# EAGLE design PIC18F2550-USB-HID-LC-Meter (EAGLE 7.7.0)
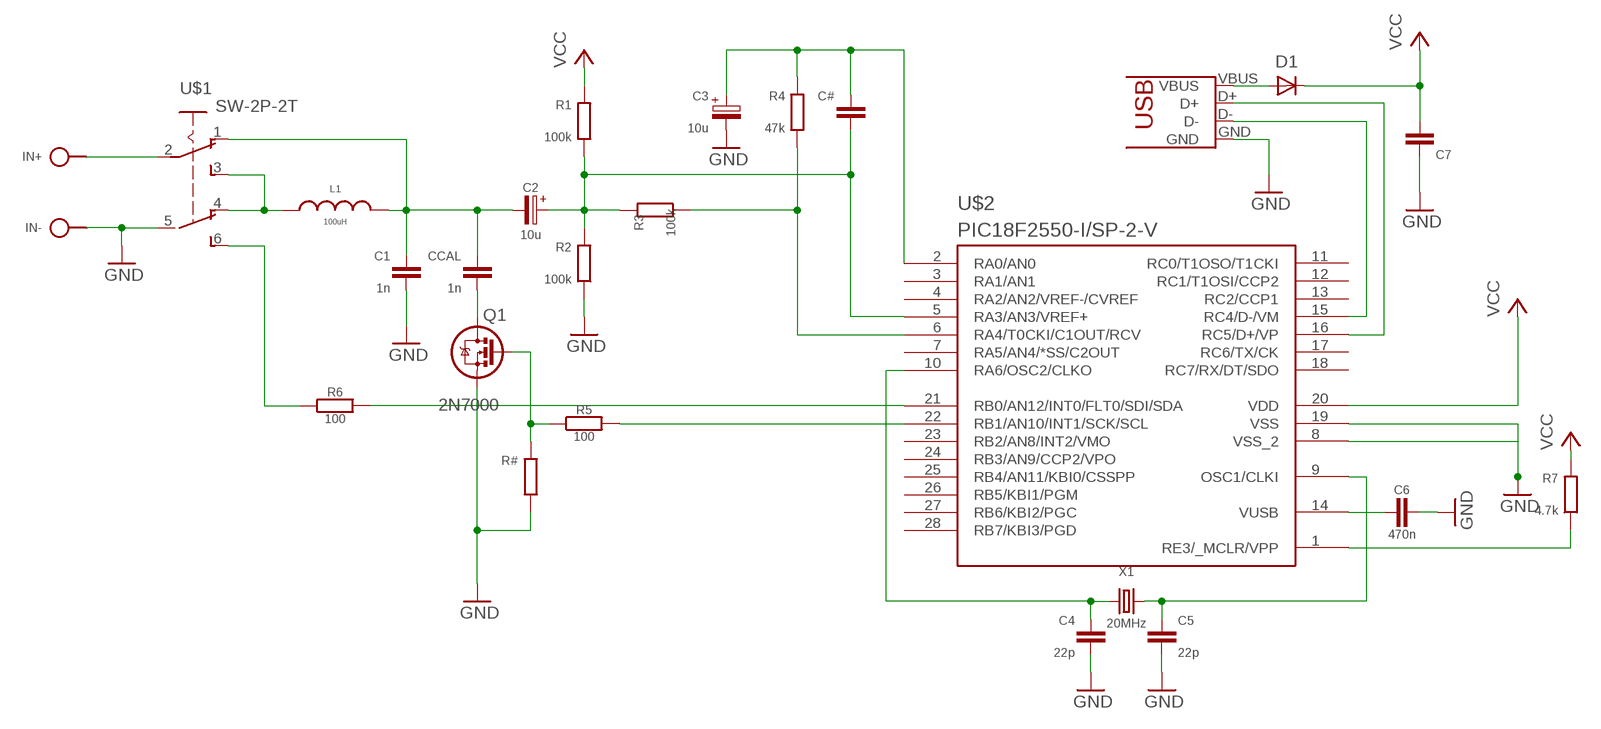
[diagram p0: schematic, sheet 1]

## Parts
C1  1n  C050-020X036  [C050-020X036]
C2  10u  CPOLE2,5-4/V  [E2.5-4/V]
C3  10u  CPOLE2,5-4  [E2,5-4]
C4  22p  C025-015X024  [C025-015X024/V]
C5  22p  C025-015X024  [C025-015X024/V]
C6  470n  C050-020X036  [C050-020X036]
C7  C050-020X036  [C050-020X036]
C#  C050-020X036  [C050-020X036]
CCAL  1n  C050-020X036  [C050-020X036]
D1  1N414834-5  [DO34-5]
IN+  SPAD  [SPAD]
IN-  SPAD  [SPAD]
J1  USB-PRINT  [USB-B-PRINT]
L1  100uH  L04/7-M  [L-04/7-M]
Q1  2N7000  [TO92]
R1  100k  R0202/7  [0202/7]
R2  100k  R0202/7  [0202/7]
R3  100k  R0202/7  [0202/7]
R4  47k  R0202/7  [0202/7]
R5  100  R0202/7  [0202/7]
R6  100  R0202/7  [0202/7]
R7  4.7k  R0202/7  [0202/7]
R#  R0202/7  [0202/7]
U$1  SW-2P-2T  [SLSW-2P2T]
U$2  PIC18F2550-I/SP-2-V  [DIL28-3/V]
X1  20MHz  CRYSTALHC49  [HC49]

## Nets
GND: C1.2 C3.- C4.2 C5.2 C6.2 C7.1 IN-.1 J1.GND Q1.1(S) R2.1 R#.1 U$1.5(P1) U$2.8(VSS_2) U$2.19(VSS)
N$1: Q1.2(G) R5.1 R#.2
N$2: R7.1 U$2.1(RE3/_MCLR/VPP)
N$3: J1.D- U$2.15(RC4/D-/VM)
N$4: J1.D+ U$2.16(RC5/D+/VP)
N$6: C2.+ C#.2 R1.1 R2.2 R3.2 U$2.5(RA3/AN3/VREF+)
N$7: C3.+ C#.1 R4.2 U$2.2(RA0/AN0)
N$8: R3.1 R4.1 U$2.6(RA4/T0CKI/C1OUT/RCV)
N$9: C1.1 C2.- CCAL.1 L1.2 U$1.1(O)
N$10: R5.2 U$2.22(RB1/AN10/INT1/SCK/SCL)
N$11: CCAL.2 Q1.3(D)
N$12: C4.1 U$2.10(RA6/OSC2/CLKO) X1.1
N$13: C5.1 U$2.9(OSC1/CLKI) X1.2
N$14: C6.1 U$2.14(VUSB)
N$15: L1.1 U$1.3(S) U$1.4(O1)
N$16: IN+.1 U$1.2(P)
N$17: R6.1 U$1.6(S1)
N$18: R6.2 U$2.21(RB0/AN12/INT0/FLT0/SDI/SDA)
VCC: C7.2 D1.C R1.2 R7.2 U$2.20(VDD)
VDD: D1.A J1.VBUS
Unconnected: U$2.3(RA1/AN1) U$2.4(RA2/AN2/VREF-/CVREF) U$2.7(RA5/AN4/*SS/C2OUT) U$2.11(RC0/T1OSO/T1CKI) U$2.12(RC1/T1OSI/CCP2) U$2.13(RC2/CCP1) U$2.17(RC6/TX/CK) U$2.18(RC7/RX/DT/SDO) U$2.23(RB2/AN8/INT2/VMO) U$2.24(RB3/AN9/CCP2/VPO) U$2.25(RB4/AN11/KBI0/CSSPP) U$2.26(RB5/KBI1/PGM) U$2.27(RB6/KBI2/PGC) U$2.28(RB7/KBI3/PGD)

## Library data of the parts
C1 C4-C7 C# CCAL = c:C: CAPACITOR, European symbol
C2 C3 = c:CPOL: POLARIZED CAPACITOR, European symbol
D1 = d:1N4148
IN+ IN- = pad:SPAD
J1 = usb:USB: USB Connectors USB-B-PTH is fully proven SKU : PRT-00139 USB-miniB is fully proven SKU : PRT-00587 USB-A-PCB is untested. USB-A-H is throughly reviewed, but untested. Spark Fun Electronics SKU : PRT-00437 USB-B-SMT is throughly reviewed, but untested. Needs silkscreen touching up. USB-A-S has not been used/tested USB-MB-H has not been used/tested
L1 = r:L
Q1 = t:2N7000
R1-R7 R# = r:R: RESISTOR, European symbol
U$1 = sw:SW-2P-2T
U$2 = mcu:PIC18F2550-I/SP-2
X1 = q:CRYSTAL

## Board
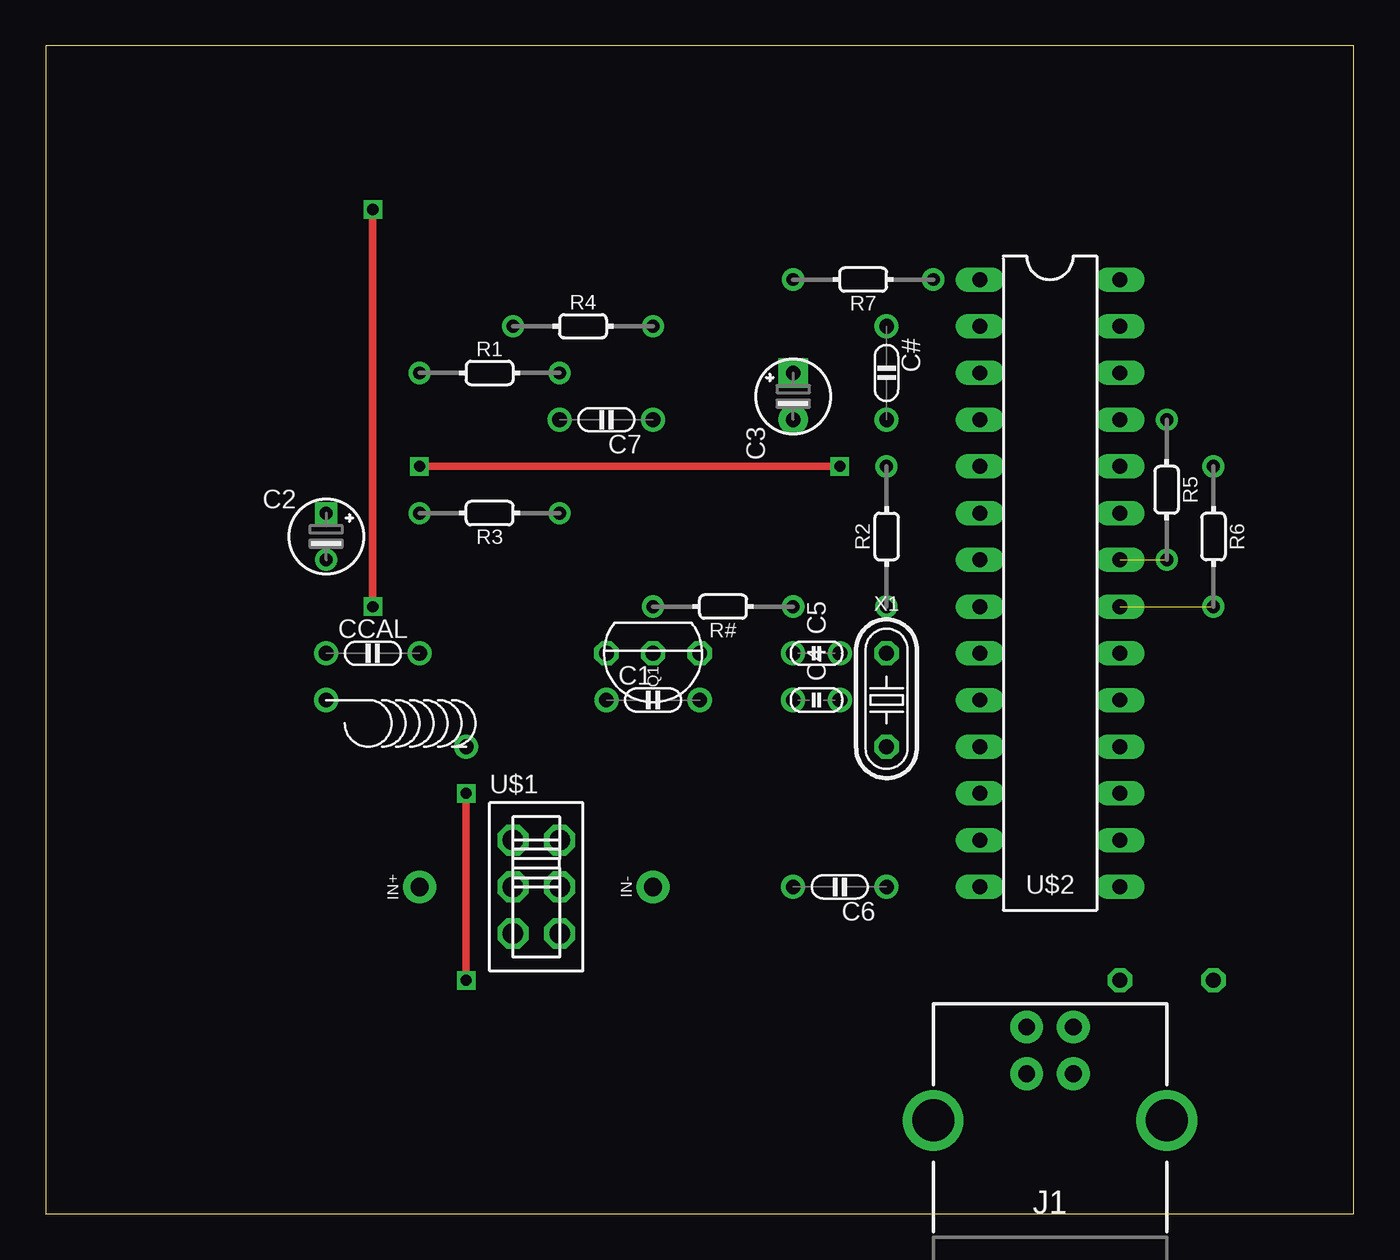
[diagram p1: board, top side]
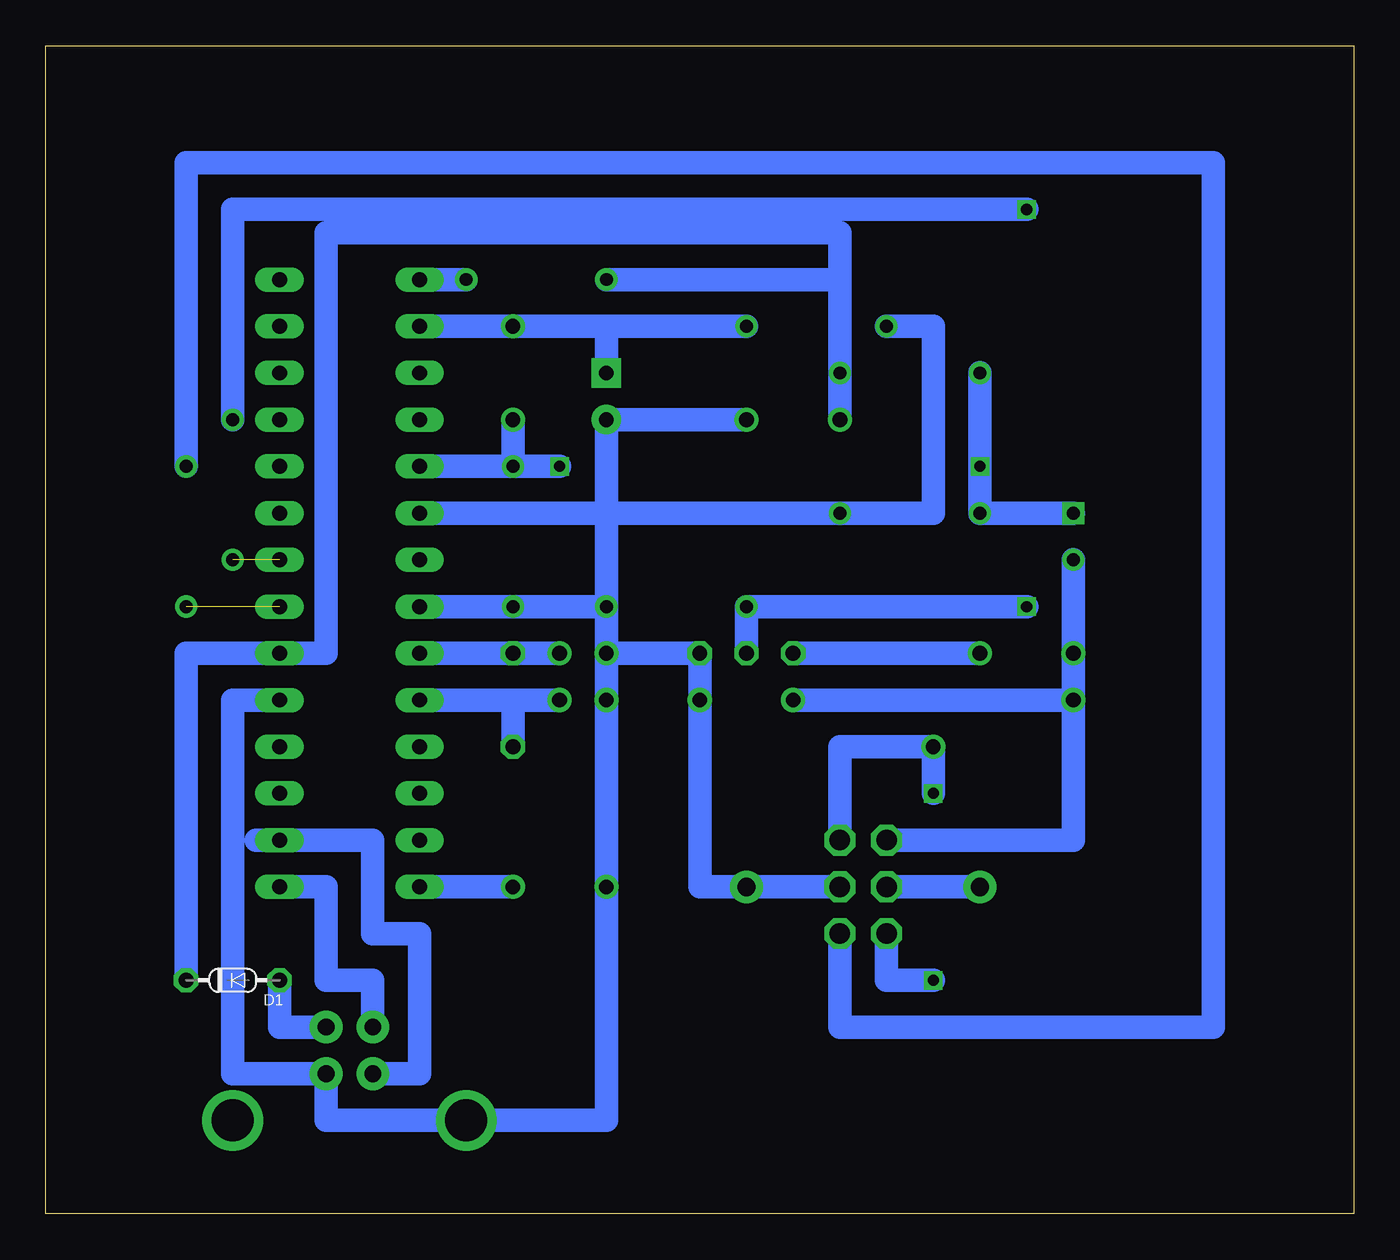
[diagram p2: board, bottom side, seen from below]

Size 71.12 x 63.5 mm. Coordinates in mm from the lower left corner, seen from the top.
Outline: 0,0 71.12,0 71.12,63.5 0,63.5 0,0
Copper layers (1*16): Top 0.035mm / dielectric 1.5mm / Bottom 0.035mm
Design rules "default": minimum track width 10mil, minimum drill 24mil, track to track 8mil, track to pad 8mil, pad to pad 8mil, via to via 8mil, smd to smd 8mil, copper to edge 40mil, drill to drill 8mil, minimum pad ring 10mil, minimum via ring 8mil, stop-mask expansion 4mil, vias tented up to drill 0mil, thermal gap 10mil

### Footprints (pad centres in the part's own frame; a part is rotated, then mirrored left to right if it is on the bottom)
C050-020X036 = drill 0.8: 1 0,-2.54; 2 0,2.54
E2.5-4/V = drill 0.7 square: + 0,1.27 | drill 0.7: - 0,-1.27
E2,5-4 = drill 0.8 pad 1.6 square: + 1.27,0 | drill 0.8 pad 1.6: - -1.27,0
C025-015X024/V = drill 0.8: 1 0,1.27; 2 0,-1.27
DO34-5 = drill 0.813 octagon: A 2.54,0; C -2.54,0
SPAD = drill 1 pad 1.778: 1 0,0
USB-B-PRINT = drill 0.914 pad 1.778: D+ 2.54,0; D- 5.08,0; GND 2.54,-2.54; VBUS 5.08,-2.54 | drill 2.286: P$1 0,-7.62; P$2 0,5.08
L-04/10-M = drill 0.8: 1 1.27,3.81; 2 -1.27,-3.81
TO92 = drill 0.813 octagon: 1 -2.54,0; 2 0,0; 3 2.54,0
0202/7 = drill 0.7: 1 -3.81,0; 2 3.81,0
SLSW-2P2T = drill 1.118 pad 1.524 octagon: 1 2.54,1.27; 2 0,1.27; 3 -2.54,1.27; 4 2.54,-1.27; 5 0,-1.27; 6 -2.54,-1.27
DIL28-3/V = drill 0.813 long: 1 -3.81,16.51; 2 -3.81,13.97; 3 -3.81,11.43; 4 -3.81,8.89; 5 -3.81,6.35; 6 -3.81,3.81; 7 -3.81,1.27; 8 -3.81,-1.27; 9 -3.81,-3.81; 10 -3.81,-6.35; 11 -3.81,-8.89; 12 -3.81,-11.43; 13 -3.81,-13.97; 14 -3.81,-16.51; 15 3.81,-16.51; 16 3.81,-13.97; 17 3.81,-11.43; 18 3.81,-8.89; 19 3.81,-6.35; 20 3.81,-3.81; 21 3.81,-1.27; 22 3.81,1.27; 23 3.81,3.81; 24 3.81,6.35; 25 3.81,8.89; 26 3.81,11.43; 27 3.81,13.97; 28 3.81,16.51
HC49 = drill 0.813 octagon: 1 0,-2.54; 2 0,2.54

### Placement (x,y rotation side)
C1  33.02,27.94 270 top
C2  15.24,36.83 0 top
C3  40.64,44.45 90 top
C4  41.91,27.94 270 top
C5  41.91,30.48 270 top
C6  43.18,17.78 90 top
C7  30.48,43.18 90 top
C#  45.72,45.72 180 top
CCAL  17.78,30.48 270 top
D1  60.96,12.7 0 bottom
IN+  20.32,17.78 0 top
IN-  33.02,17.78 0 top
J1  53.34,5.08 90 top
L1  100μH  [L-04/10-M]  19.05,26.67 270 top
Q1  33.02,30.48 180 top
R1  100kΩ  [0202/7]  24.13,45.72 0 top
R2  100kΩ  [0202/7]  45.72,36.83 90 top
R3  100kΩ  [0202/7]  24.13,38.1 180 top
R4  47kΩ  [0202/7]  29.21,48.26 0 top
R5  100Ω  [0202/7]  60.96,39.37 270 top
R6  100Ω  [0202/7]  63.5,36.83 270 top
R7  4.7kΩ  [0202/7]  44.45,50.8 180 top
R#  36.83,33.02 180 top
U$1  26.67,17.78 90 top
U$2  54.61,34.29 0 top
X1  45.72,27.94 0 top

### Tracks (layer width: path | path; a pad name or v marks a point on that pad's centre or on a via)
GND
  Bottom 1.27: U$2.8 R2.1 R#.1 | R#.1 C5.2 | C5.2 C4.2 C6.2 40.64,5.08 55.88,5.08 J1.GND 60.96,7.62 60.96,27.94 U$2.19 | C7.1 C3.- R#.1 | C5.2 Q1.1 C1.2 35.56,17.78 IN-.1 U$1.5
N$1  (via drill 0.6)
  Top 0.406: v17.78,54.61 v17.78,33.02
  Bottom 1.27: R5.1 60.96,54.61 v17.78,54.61 | v17.78,33.02 R#.2 Q1.2
N$2
  Bottom 1.27: U$2.1 R7.1
N$3
  Bottom 1.27: J1.D- 53.34,12.7 55.88,12.7 55.88,17.78 U$2.15
N$4
  Bottom 1.27: J1.D+ 50.8,7.62 50.8,15.24 53.34,15.24 53.34,20.32 U$2.16 59.69,20.32
N$6  (via drill 0.6)
  Top 0.406: v43.18,40.64 v20.32,40.64
  Bottom 1.27: R2.2 v43.18,40.64 | R1.1 v20.32,40.64 R3.2 C2.+ | U$2.5 R2.2 | R2.2 C#.2
N$7
  Bottom 1.27: R4.2 40.64,48.26 | C3.+ 40.64,48.26 | 40.64,48.26 C#.1 U$2.2
N$8
  Bottom 1.27: U$2.6 R3.1 22.86,38.1 22.86,48.26 R4.1
N$9
  Bottom 1.27: 25.4,27.94 C1.1 L1.2 | L1.2 CCAL.1 C2.- | U$1.1 15.24,20.32 L1.2
N$10  (1 unrouted)
N$11
  Bottom 1.27: Q1.3 CCAL.2
N$12
  Bottom 1.27: U$2.10 45.72,27.94 | C4.1 45.72,27.94 | 45.72,27.94 X1.1
N$13
  Bottom 1.27: C5.1 X1.2 U$2.9
N$14
  Bottom 1.27: C6.1 U$2.14
N$15  (via drill 0.6)
  Top 0.406: v22.86,12.7 v22.86,22.86
  Bottom 1.27: U$1.3 25.4,12.7 v22.86,12.7 | v22.86,22.86 L1.1 27.94,25.4 U$1.4
N$16
  Bottom 1.27: U$1.2 IN+.1
N$17
  Bottom 1.27: R6.1 63.5,57.15 7.62,57.15 7.62,10.16 27.94,10.16 U$1.6
N$18  (1 unrouted)
VCC
  Bottom 1.27: D1.C 63.5,30.48 U$2.20 55.88,30.48 55.88,53.34 27.94,53.34 27.94,50.8 | R1.2 C7.2 27.94,50.8 | R7.2 27.94,50.8
VDD
  Bottom 1.27: J1.VBUS 58.42,10.16 D1.A